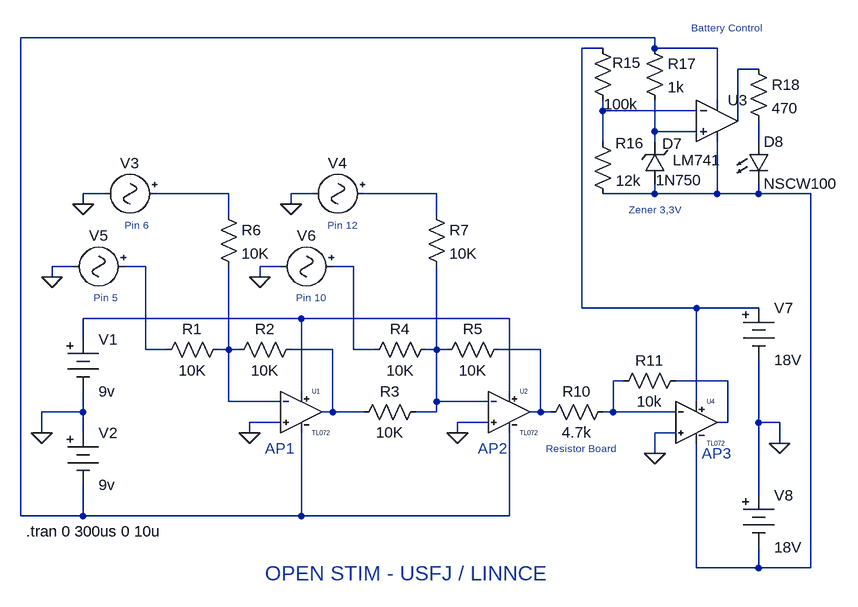
[diagram p0: schematic Simulation.asc]
Simulation.asc, the LTspice schematic file:
Version 4
SHEET 1 1540 680
WIRE 704 -448 -272 -448
WIRE 624 -432 592 -432
WIRE 704 -432 704 -448
WIRE 800 -432 704 -432
WIRE 864 -400 832 -400
WIRE 800 -352 800 -432
WIRE 624 -336 624 -352
WIRE 768 -336 624 -336
WIRE 832 -320 832 -400
WIRE 704 -304 704 -352
WIRE 768 -304 704 -304
WIRE 624 -288 624 -336
WIRE 704 -288 704 -304
WIRE 864 -288 864 -320
WIRE -144 -208 -176 -208
WIRE 48 -208 -64 -208
WIRE 176 -208 144 -208
WIRE 368 -208 256 -208
WIRE 704 -208 704 -224
WIRE 704 -208 624 -208
WIRE 800 -208 800 -288
WIRE 800 -208 704 -208
WIRE 864 -208 864 -224
WIRE 864 -208 800 -208
WIRE 944 -208 864 -208
WIRE -176 -192 -176 -208
WIRE 144 -192 144 -208
WIRE 48 -176 48 -208
WIRE 368 -176 368 -208
WIRE -192 -96 -224 -96
WIRE -80 -96 -112 -96
WIRE 128 -96 96 -96
WIRE 240 -96 208 -96
WIRE -224 -80 -224 -96
WIRE 96 -80 96 -96
WIRE 592 -32 592 -432
WIRE 768 -32 592 -32
WIRE 864 -32 768 -32
WIRE 160 -16 -176 -16
WIRE 480 -16 160 -16
WIRE -176 16 -176 -16
WIRE -80 32 -80 -96
WIRE -48 32 -80 32
WIRE 48 32 48 -96
WIRE 48 32 32 32
WIRE 64 32 48 32
WIRE 208 32 144 32
WIRE 240 32 240 -96
WIRE 272 32 240 32
WIRE 368 32 368 -96
WIRE 368 32 352 32
WIRE 384 32 368 32
WIRE 528 32 464 32
WIRE 656 80 640 80
WIRE 816 80 736 80
WIRE 160 96 160 -16
WIRE 480 96 480 -16
WIRE 48 112 48 32
WIRE 128 112 48 112
WIRE 368 112 368 32
WIRE 448 112 368 112
WIRE 768 112 768 -32
WIRE -176 128 -176 96
WIRE -176 128 -240 128
WIRE 208 128 208 32
WIRE 208 128 192 128
WIRE 256 128 208 128
WIRE 368 128 368 112
WIRE 368 128 336 128
WIRE 528 128 528 32
WIRE 528 128 512 128
WIRE 544 128 528 128
WIRE 640 128 640 80
WIRE 640 128 624 128
WIRE 736 128 640 128
WIRE 128 144 80 144
WIRE 448 144 400 144
WIRE 816 144 816 80
WIRE 816 144 800 144
WIRE 864 144 864 48
WIRE 896 144 864 144
WIRE -240 160 -240 128
WIRE -176 160 -176 128
WIRE 80 160 80 144
WIRE 400 160 400 144
WIRE 736 160 704 160
WIRE 896 176 896 144
WIRE 704 192 704 160
WIRE 864 256 864 144
WIRE -272 288 -272 -448
WIRE -176 288 -176 240
WIRE -176 288 -272 288
WIRE 160 288 160 160
WIRE 160 288 -176 288
WIRE 480 288 480 160
WIRE 480 288 160 288
WIRE 768 368 768 176
WIRE 864 368 864 336
WIRE 864 368 768 368
WIRE 944 368 944 -208
WIRE 944 368 864 368
FLAG -240 160 0
FLAG 80 160 0
FLAG 400 160 0
FLAG -224 -80 0
FLAG 96 -80 0
FLAG 704 192 0
FLAG 896 176 0
FLAG -176 -192 0
FLAG 144 -192 0
SYMBOL res 48 16 R90
WINDOW 0 0 56 VBottom 2
WINDOW 3 32 56 VTop 2
SYMATTR InstName R1
SYMATTR Value 10K
SYMATTR SpiceLine tol=1 pwr=0.1
SYMBOL res 160 16 R90
WINDOW 0 0 56 VBottom 2
WINDOW 3 32 56 VTop 2
SYMATTR InstName R2
SYMATTR Value 10K
SYMATTR SpiceLine tol=1 pwr=0.1
SYMBOL res 352 112 R90
WINDOW 0 0 56 VBottom 2
WINDOW 3 32 56 VTop 2
SYMATTR InstName R3
SYMATTR Value 10K
SYMATTR SpiceLine tol=1 pwr=0.1
SYMBOL res 368 16 R90
WINDOW 0 0 56 VBottom 2
WINDOW 3 32 56 VTop 2
SYMATTR InstName R4
SYMATTR Value 10K
SYMATTR SpiceLine tol=1 pwr=0.1
SYMBOL Misc\\battery -176 0 R0
WINDOW 123 0 0 Left 2
WINDOW 39 0 0 Left 2
SYMATTR InstName V1
SYMATTR Value 9v
SYMBOL Misc\\battery -176 144 R0
WINDOW 123 0 0 Left 2
WINDOW 39 0 0 Left 2
SYMATTR InstName V2
SYMATTR Value 9v
SYMBOL res 480 16 R90
WINDOW 0 0 56 VBottom 2
WINDOW 3 32 56 VTop 2
SYMATTR InstName R5
SYMATTR Value 10K
SYMATTR SpiceLine tol=1 pwr=0.1
SYMBOL Misc\\signal -96 -96 R90
WINDOW 0 -32 56 VBottom 2
WINDOW 3 32 56 Invisible 2
WINDOW 123 0 0 Left 2
WINDOW 39 0 0 Left 2
SYMATTR InstName V5
SYMATTR Value PULSE(0 5 70u 10u 10u 50u 140u 20)
SYMBOL Misc\\signal 224 -96 R90
WINDOW 0 -32 56 VBottom 2
WINDOW 3 32 56 Invisible 2
WINDOW 123 0 0 Left 2
WINDOW 39 0 0 Left 2
SYMATTR InstName V6
SYMATTR Value PULSE(0 5 0 10u 10u 50u 140u 20)
SYMBOL zener 720 -224 R180
WINDOW 0 -26 61 Left 2
WINDOW 3 -57 5 Left 2
SYMATTR InstName D7
SYMATTR Value 1N750
SYMATTR Description Diode
SYMATTR Type diode
SYMBOL LED 848 -288 R0
SYMATTR InstName D8
SYMATTR Value NSCW100
SYMATTR Description Diode
SYMATTR Type diode
SYMBOL res 640 -336 R180
WINDOW 0 -43 74 Left 2
WINDOW 3 -38 10 Left 2
SYMATTR InstName R15
SYMATTR Value 100k
SYMATTR SpiceLine tol=1 pwr=0.1
SYMBOL res 608 -304 R0
WINDOW 0 35 18 Left 2
SYMATTR InstName R16
SYMATTR Value 12k
SYMBOL res 688 -448 R0
SYMATTR InstName R17
SYMATTR Value 1k
SYMBOL Opamps\\LM741 800 -384 R0
WINDOW 3 -68 124 Left 2
SYMATTR InstName U3
SYMBOL res 848 -416 R0
SYMATTR InstName R18
SYMATTR Value 470
SYMBOL Opamps\\TL072 160 64 R0
SYMATTR InstName U1
SYMBOL Opamps\\TL072 480 64 R0
SYMATTR InstName U2
SYMBOL Opamps\\TL072 768 80 R0
SYMATTR InstName U4
SYMBOL res 640 112 R90
WINDOW 0 0 56 VBottom 2
WINDOW 3 32 56 VTop 2
SYMATTR InstName R10
SYMATTR Value 4.7k
SYMBOL res 752 64 R90
WINDOW 0 0 56 VBottom 2
WINDOW 3 32 56 VTop 2
SYMATTR InstName R11
SYMATTR Value 10k
SYMBOL Misc\\battery 864 -48 R0
WINDOW 123 0 0 Left 2
WINDOW 39 0 0 Left 2
SYMATTR InstName V7
SYMATTR Value 18V
SYMBOL Misc\\battery 864 240 R0
WINDOW 123 0 0 Left 2
WINDOW 39 0 0 Left 2
SYMATTR InstName V8
SYMATTR Value 18V
SYMBOL res 32 -192 R0
SYMATTR InstName R6
SYMATTR Value 10K
SYMBOL res 352 -192 R0
SYMATTR InstName R7
SYMATTR Value 10K
SYMBOL Misc\\signal -48 -208 R90
WINDOW 0 -32 56 VBottom 2
WINDOW 3 32 56 Invisible 2
WINDOW 123 0 0 Left 2
WINDOW 39 0 0 Left 2
SYMATTR InstName V3
SYMATTR Value PULSE(0 5 0 10u 10u 30u 140u 20)
SYMBOL Misc\\signal 272 -208 R90
WINDOW 0 -32 56 VBottom 2
WINDOW 3 32 56 Invisible 2
WINDOW 123 0 0 Left 2
WINDOW 39 0 0 Left 2
SYMATTR InstName V4
SYMATTR Value PULSE(0 5 90u 10u 10u 30u 140u 20)
TEXT -264 312 Left 2 !.tran 0 300us 0 10u
TEXT 664 -184 Left 1 ;Zener 3,3V
TEXT 536 184 Left 1 ;Resistor Board
TEXT 760 -464 Left 1 ;Battery Control
TEXT -160 -48 Left 1 ;Pin 5
TEXT -112 -160 Left 1 ;Pin 6
TEXT 152 -48 Left 1 ;Pin 10
TEXT 200 -160 Left 1 ;Pin 12
TEXT 104 376 Left 3 ;OPEN STIM - USFJ / LINNCE
TEXT 104 184 Left 2 ;AP1
TEXT 432 184 Left 2 ;AP2
TEXT 776 192 Left 2 ;AP3

The netlist it stands for:
* Simulation.asc
R1 N013 N010 10K tol=1 pwr=0.1
R2 N014 N013 10K tol=1 pwr=0.1
R3 N015 N014 10K tol=1 pwr=0.1
R4 N015 N011 10K tol=1 pwr=0.1
V1 N012 0 9v
V2 0 N001 9v
R5 N016 N015 10K tol=1 pwr=0.1
V5 N010 0 PULSE(0 5 70u 10u 10u 50u 140u 20)
V6 N011 0 PULSE(0 5 0 10u 10u 50u 140u 20)
D7 N009 N005 1N750
D8 N006 N009 NSCW100
R15 N004 N002 100k tol=1 pwr=0.1
R16 N004 N009 12k
R17 N001 N005 1k
XU3 N005 N004 N001 N009 N003 LM741  ; pins In+ In- V+ V- OUT
R18 N003 N006 470
XU1 0 N013 N012 N001 N014 TL072  ; pins In+ In- V+ V- OUT
XU2 0 N015 N012 N001 N016 TL072  ; pins In+ In- V+ V- OUT
XU4 0 N017 N002 N009 N018 TL072  ; pins In+ In- V+ V- OUT
R10 N017 N016 4.7k
R11 N018 N017 10k
V7 N002 0 18V
V8 0 N009 18V
R6 N007 N013 10K
R7 N008 N015 10K
V3 N007 0 PULSE(0 5 0 10u 10u 30u 140u 20)
V4 N008 0 PULSE(0 5 90u 10u 10u 30u 140u 20)
.model D D
.lib standard.dio
.tran 0 300us 0 10u
* Zener 3,3V
* Resistor Board
* Battery Control
* Pin 5
* Pin 6
* Pin 10
* Pin 12
* OPEN STIM - USFJ / LINNCE
* AP1
* AP2
* AP3
.lib LM741.lib
.lib TL072.sub
.backanno
.end